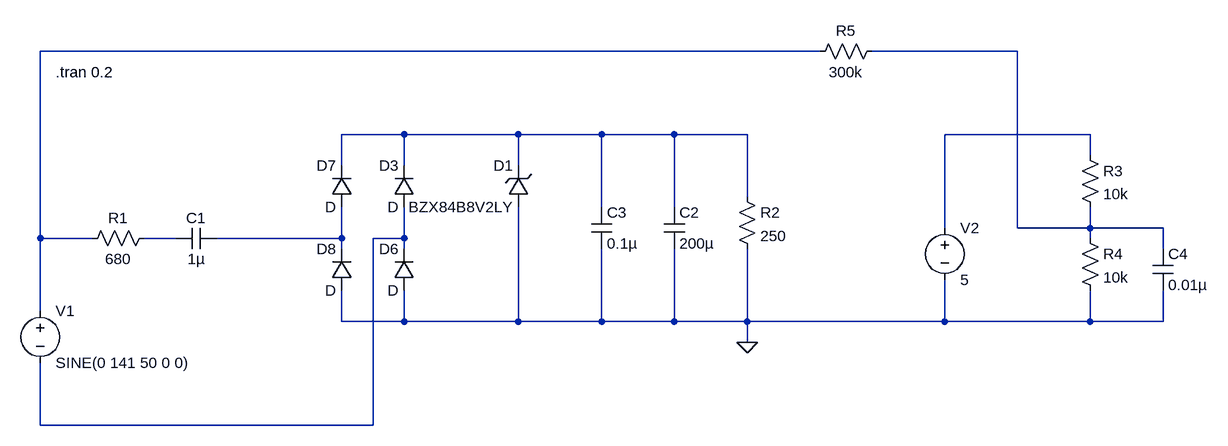
[diagram p0: schematic sim_ver1.asc]
sim_ver1.asc, the LTspice schematic file:
Version 4
SHEET 1 2076 680
WIRE 1472 -224 272 -224
WIRE 1776 -224 1552 -224
WIRE 832 -96 736 -96
WIRE 1008 -96 832 -96
WIRE 1136 -96 1008 -96
WIRE 1248 -96 1136 -96
WIRE 1360 -96 1248 -96
WIRE 1888 -96 1664 -96
WIRE 1888 -64 1888 -96
WIRE 736 -48 736 -96
WIRE 832 -48 832 -96
WIRE 1008 -48 1008 -96
WIRE 1360 0 1360 -96
WIRE 1136 16 1136 -96
WIRE 1248 16 1248 -96
WIRE 1664 48 1664 -96
WIRE 1776 48 1776 -224
WIRE 1888 48 1888 16
WIRE 1888 48 1776 48
WIRE 2000 48 1888 48
WIRE 272 64 272 -224
WIRE 352 64 272 64
WIRE 480 64 432 64
WIRE 736 64 736 16
WIRE 736 64 544 64
WIRE 832 64 832 16
WIRE 832 64 784 64
WIRE 1888 64 1888 48
WIRE 736 80 736 64
WIRE 832 80 832 64
WIRE 2000 80 2000 48
WIRE 272 176 272 64
WIRE 736 192 736 144
WIRE 832 192 832 144
WIRE 832 192 736 192
WIRE 1008 192 1008 16
WIRE 1008 192 832 192
WIRE 1136 192 1136 80
WIRE 1136 192 1008 192
WIRE 1248 192 1248 80
WIRE 1248 192 1136 192
WIRE 1360 192 1360 80
WIRE 1360 192 1248 192
WIRE 1664 192 1664 128
WIRE 1664 192 1360 192
WIRE 1888 192 1888 144
WIRE 1888 192 1664 192
WIRE 2000 192 2000 144
WIRE 2000 192 1888 192
WIRE 1360 224 1360 192
WIRE 272 352 272 256
WIRE 784 352 784 64
WIRE 784 352 272 352
FLAG 1360 224 0
SYMBOL voltage 272 160 R0
WINDOW 123 0 0 Left 0
WINDOW 39 0 0 Left 0
SYMATTR InstName V1
SYMATTR Value SINE(0 141 50 0 0)
SYMBOL res 448 48 R90
WINDOW 0 0 56 VBottom 2
WINDOW 3 32 56 VTop 2
SYMATTR InstName R1
SYMATTR Value 680
SYMATTR SpiceLine pwr=1
SYMBOL cap 544 48 R90
WINDOW 0 0 32 VBottom 2
WINDOW 3 32 32 VTop 2
SYMATTR InstName C1
SYMATTR Value 1µ
SYMBOL zener 1024 16 R180
WINDOW 0 24 64 Left 2
WINDOW 3 24 0 Left 2
SYMATTR InstName D1
SYMATTR Value BZX84B8V2LY
SYMBOL cap 1232 16 R0
SYMATTR InstName C2
SYMATTR Value 200µ
SYMBOL res 1344 -16 R0
SYMATTR InstName R2
SYMATTR Value 250
SYMBOL voltage 1664 32 R0
WINDOW 123 0 0 Left 0
WINDOW 39 0 0 Left 0
SYMATTR InstName V2
SYMATTR Value 5
SYMBOL res 1872 -80 R0
SYMATTR InstName R3
SYMATTR Value 10k
SYMBOL res 1872 48 R0
SYMATTR InstName R4
SYMATTR Value 10k
SYMBOL res 1568 -240 R90
WINDOW 0 0 56 VBottom 2
WINDOW 3 32 56 VTop 2
SYMATTR InstName R5
SYMATTR Value 300k
SYMATTR SpiceLine pwr=1
SYMBOL cap 1120 16 R0
SYMATTR InstName C3
SYMATTR Value 0.1µ
SYMBOL cap 1984 80 R0
SYMATTR InstName C4
SYMATTR Value 0.01µ
SYMBOL diode 848 16 R180
WINDOW 0 24 64 Left 2
WINDOW 3 24 0 Left 2
SYMATTR InstName D3
SYMBOL diode 848 144 R180
WINDOW 0 24 64 Left 2
WINDOW 3 24 0 Left 2
SYMATTR InstName D6
SYMBOL diode 752 16 R180
WINDOW 0 24 64 Left 2
WINDOW 3 24 0 Left 2
SYMATTR InstName D7
SYMBOL diode 752 144 R180
WINDOW 0 24 64 Left 2
WINDOW 3 24 0 Left 2
SYMATTR InstName D8
TEXT 296 -192 Left 2 !.tran 0.2

The netlist it stands for:
* sim_ver1.asc
V1 N001 N007 SINE(0 141 50 0 0)
R1 N005 N001 680 pwr=1
C1 N006 N005 1µ
D1 0 N003 BZX84B8V2LY
C2 N003 0 200µ
R2 N003 0 250
V2 N004 0 5
R3 N004 N002 10k
R4 N002 0 10k
R5 N002 N001 300k pwr=1
C3 N003 0 0.1µ
C4 N002 0 0.01µ
D3 N007 N003 D
D6 0 N007 D
D7 N006 N003 D
D8 0 N006 D
.model D D
.lib standard.dio
.tran 0.2
.backanno
.end